# EAGLE schematic Mega 2560 Z21 (EAGLE 9.6.0)
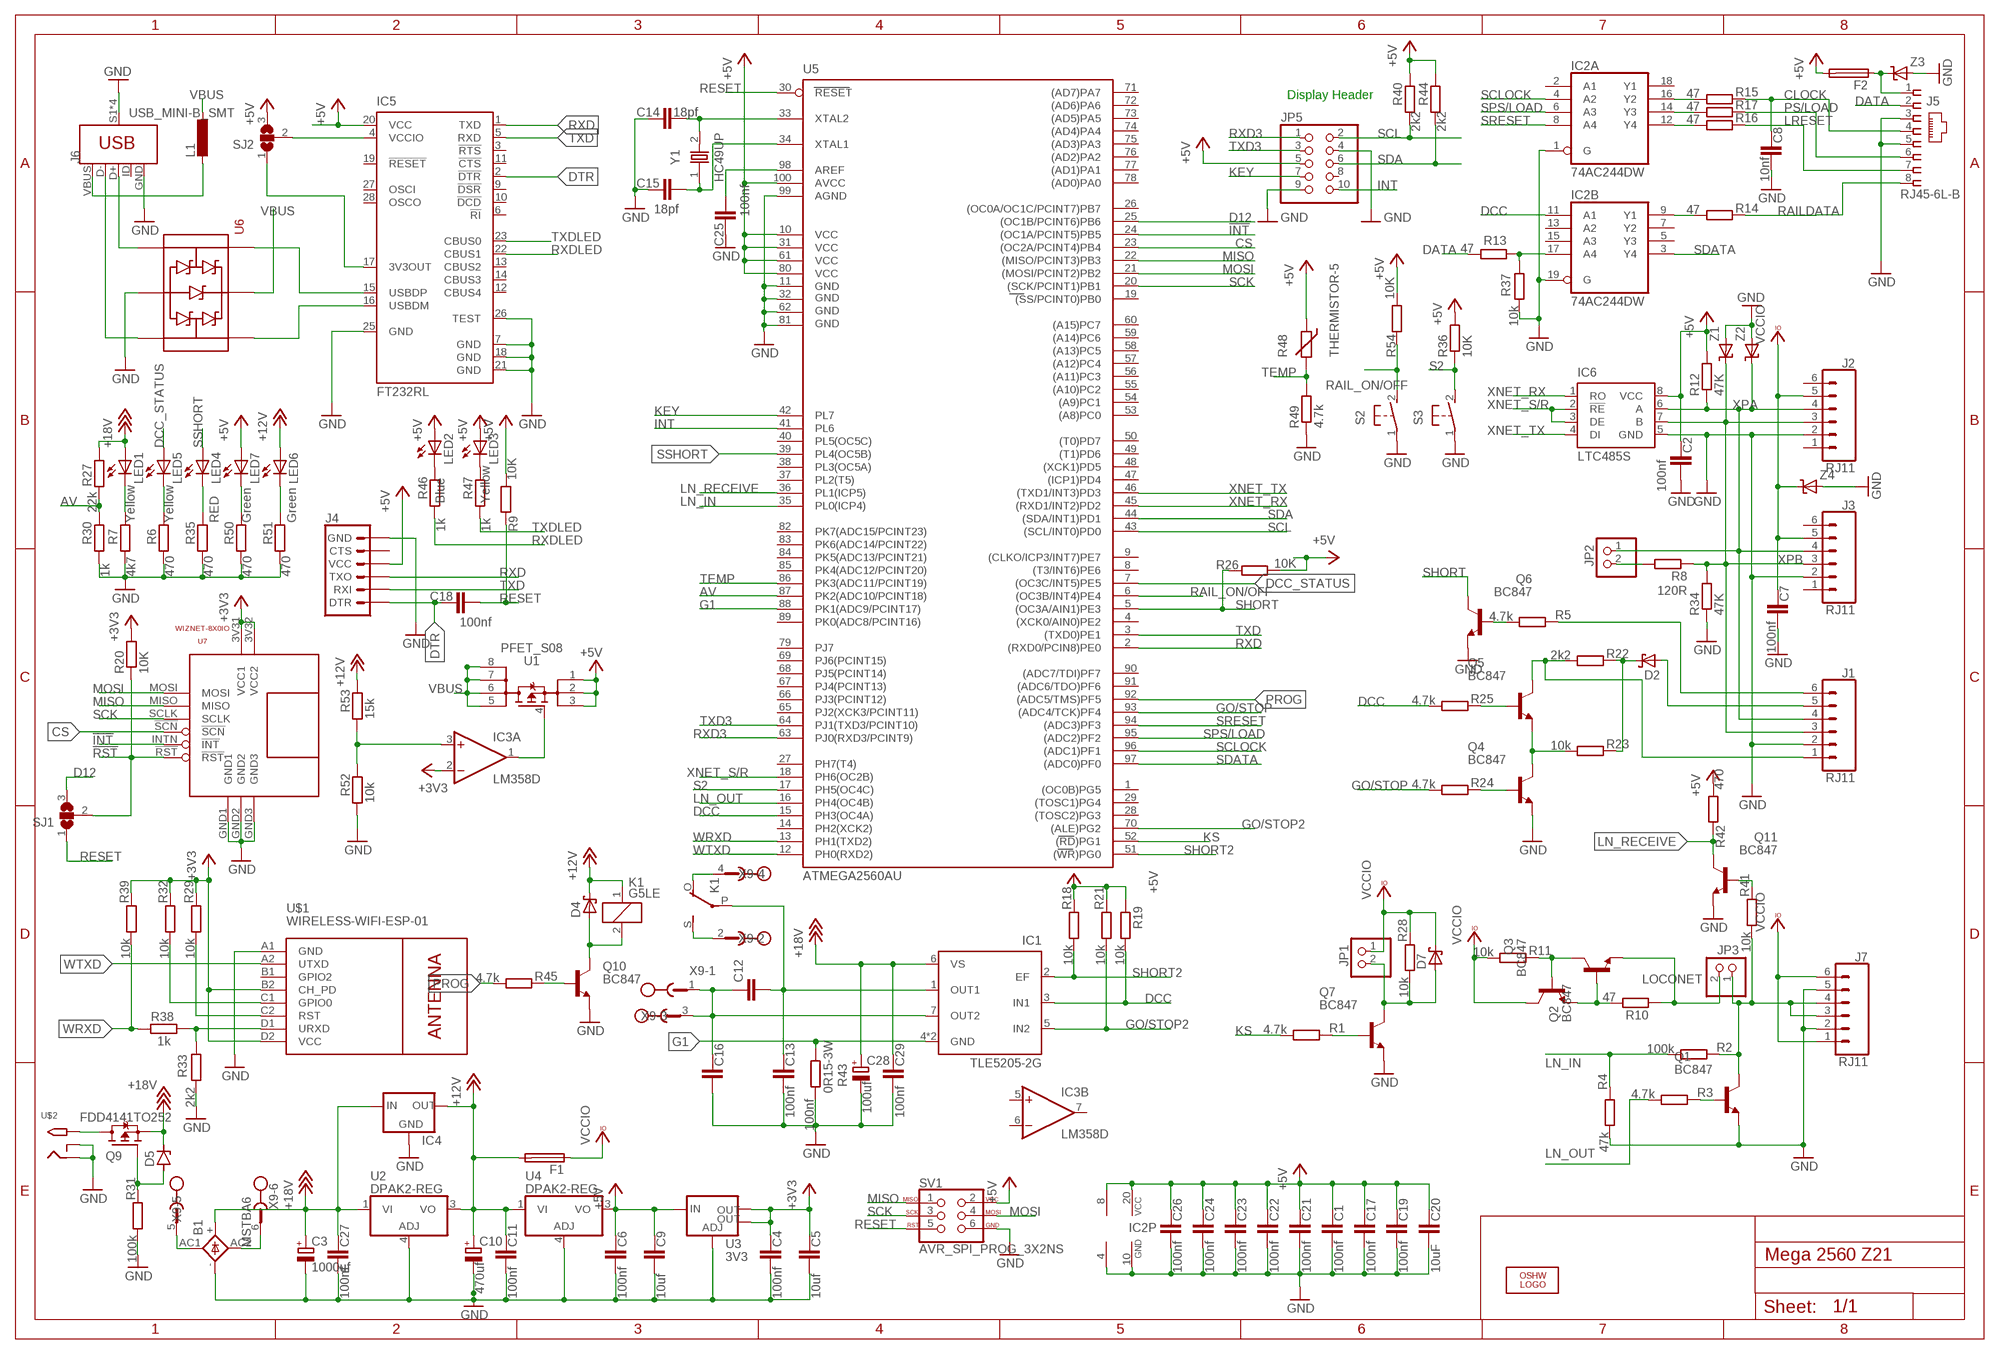
[diagram p0: schematic, sheet 1]

## Parts
B1  BRIDGE_RECTIFIER_6AMP  [KBU-6D]
C1  100nf  C-EUC0603  [C0603]
C2  100nf  C-EUC0603  [C0603]
C3  1000uf  CPOL-EUE5-13  [E5-13]
C4  100nf  C-EUC0603  [C0603]
C5  10uf  C-EUC0805  [C0805]
C6  100nf  C-EUC0603  [C0603]
C7  100nf  C-EUC0603  [C0603]
C8  10nf  C-EUC0603  [C0603]
C9  10uf  C-EUC0805  [C0805]
C10  470uf  CPOL-EUE5-13  [E5-13]
C11  100nf  C-EUC0603  [C0603]
C12  C-EUC1812  [C1812]
C13  100nf  C-EUC1206  [C1206]
C14  18pf  C-EUC0603  [C0603]
C15  18pf  C-EUC0603  [C0603]
C16  100nf  C-EUC1206  [C1206]
C17  100nf  C-EUC0603  [C0603]
C18  100nf  C-EUC0603  [C0603]
C19  100nf  C-EUC0603  [C0603]
C20  10uF  C-EUC0805  [C0805]
C21  100nf  C-EUC0603  [C0603]
C22  100nf  C-EUC0603  [C0603]
C23  100nf  C-EUC0603  [C0603]
C24  100nf  C-EUC0603  [C0603]
C25  100nf  C-EUC0603  [C0603]
C26  100nf  C-EUC0603  [C0603]
C27  100nf  C-EUC0805  [C0805]
C28  100uf  CPOL-EUE2-5  [E2-5]
C29  100nf  C-EUC1206  [C1206]
D2  MICROSMD-SCHOTTKY-DIODE  [MICROSMP]
D4  MICROSMD-SCHOTTKY-DIODE  [MICROSMP]
D5  ZENER-DIODESOT23  [SOT23]
D7  MICROSMD-SCHOTTKY-DIODE  [MICROSMP]
F1  TE5  [TE5]
F2  TE5  [TE5]
IC1  TLE5205-2G  [P-TO263-7-1]
IC2  74AC244DW  [SO20W]
IC3  LM358D  [SO08]
IC4  78XXS  [78XXS]
IC5  FT232RL  [SSOP28]
IC6  LTC485S  [SOIC8]
J1  RJ11  RJ11-6  [RJ11-6]
J2  RJ11  RJ11-6  [RJ11-6]
J3  RJ11  RJ11-6  [RJ11-6]
J4  6_PIN_SERIAL_TARGET  [1X06]
J5  RJ45-6L-B  [RJ45-NO-SHIELD]
J6  USB_MINI-B_SMT  [USB-MINIB]
J7  RJ11  RJ11-6  [RJ11-6]
JP1  PINHD-1X2  [1X02]
JP2  PINHD-1X2  [1X02]
JP3  PINHD-1X2  [1X02]
JP5  PINHD-2X5  [2X05]
K1  G5LE  [G5LE]
L1  L-EUL2012C  [L2012C]
LED1  Yellow  LED3MM  [LED3MM]
LED2  Blue  LED3MM  [LED3MM]
LED3  Yellow  LED3MM  [LED3MM]
LED4  RED  LED3MM  [LED3MM]
LED5  Yellow  LED3MM  [LED3MM]
LED6  Green  LED3MM  [LED3MM]
LED7  Green  LED3MM  [LED3MM]
LOGO1  OSHW_LOGO_6MILX0200-NT  [OSHW_6X200_NOTEXT]
Q1  BC847  [SOT23]
Q2  BC847  [SOT23]
Q3  BC847  [SOT23]
Q4  BC847  [SOT23]
Q5  BC847  [SOT23]
Q6  BC847  [SOT23]
Q7  BC847  [SOT23]
Q9  FDD4141TO252  [TO252]
Q10  BC847  [SOT23]
Q11  BC847  [SOT23]
R1  4.7k  R-EU_R0603  [R0603]
R2  100k  R-EU_R0603  [R0603]
R3  4.7k  R-EU_R0603  [R0603]
R4  47k  R-EU_R0603  [R0603]
R5  4.7k  R-EU_R0603  [R0603]
R6  470  R-EU_R0603  [R0603]
R7  4k7  R-EU_R0603  [R0603]
R8  120R  R-EU_R0603  [R0603]
R9  10K  R-EU_R0603  [R0603]
R10  47  R-EU_R0603  [R0603]
R11  10k  R-EU_R0603  [R0603]
R12  47K  R-EU_R0603  [R0603]
R13  47  R-EU_R0603  [R0603]
R14  47  R-EU_R0603  [R0603]
R15  47  R-EU_R0603  [R0603]
R16  47  R-EU_R0603  [R0603]
R17  47  R-EU_R0603  [R0603]
R18  10k  R-EU_R0603  [R0603]
R19  10k  R-EU_R0603  [R0603]
R20  10K  R-EU_R0603  [R0603]
R21  10k  R-EU_R0603  [R0603]
R22  2k2  R-EU_R0603  [R0603]
R23  10k  R-EU_R0603  [R0603]
R24  4.7k  R-EU_R0603  [R0603]
R25  4.7k  R-EU_R0603  [R0603]
R26  10K  R-EU_R0603  [R0603]
R27  22k  R-EU_R0603  [R0603]
R28  10k  R-EU_R0603  [R0603]
R29  10k  R-EU_R0603  [R0603]
R30  1k  R-EU_R0603  [R0603]
R31  100k  R-EU_R0603  [R0603]
R32  10k  R-EU_R0603  [R0603]
R33  2k2  R-EU_R0603  [R0603]
R34  47K  R-EU_R0603  [R0603]
R35  470  R-EU_R0603  [R0603]
R36  10K  R-EU_R0603  [R0603]
R37  10k  R-EU_R0603  [R0603]
R38  1k  R-EU_R0603  [R0603]
R39  10k  R-EU_R0603  [R0603]
R40  2k2  R-EU_R0603  [R0603]
R41  10k  R-EU_R0603  [R0603]
R42  470  R-EU_R0603  [R0603]
R43  0R15-3W  R-EU_0817/7V  [P0817V]
R44  2k2  R-EU_R0603  [R0603]
R45  4.7k  R-EU_R0603  [R0603]
R46  1k  R-EU_R0603  [R0603]
R47  1k  R-EU_R0603  [R0603]
R48  THERMISTOR-5  [R-5]
R49  4.7k  R-EU_R0603  [R0603]
R50  470  R-EU_R0603  [R0603]
R51  470  R-EU_R0603  [R0603]
R52  10k  R-EU_R0603  [R0603]
R53  15k  R-EU_R0603  [R0603]
R54  10K  R-EU_R0603  [R0603]
S2  31-XX  [B3F-31XX]
S3  31-XX  [B3F-31XX]
SJ1  SJ2W  [SJ_2]
SJ2  SJ2W  [SJ_2]
SV1  AVR_SPI_PROG_3X2NS  [2X3-NS]
U1  PFET_S08  [SO08]
U2  DPAK2-REG  [DPAK2]
U3  3V3  V_REG_LM1117SOT223  [SOT223]
U4  DPAK2-REG  [DPAK2]
U5  ATMEGA2560AU  [TQFP100]
U6  UABLC6-2SOT23-6L  [SOT95P280X145-6N]
U7  WIZNET-8X0IO  [WIZ850IO]
U$1  WIRELESS-WIFI-ESP-01  [WIRELESS-WIFI-ESP-01]
U$2  2.1MMJACKTHM  [PJ-102A]
X9  MSTBA6  [MSTBA6]
Y1  HC49UP  [HC49UP]
Z1  TRANSZORB-SMA  [SMA]
Z2  TRANSZORB-SMA  [SMA]
Z3  TRANSZORB-SMA  [SMA]
Z4  TRANSZORB-SMA  [SMA]

## Nets
!INT: U5.24((OC1A/PCINT5)PB5) U7.INTN(!INT)
!RST: R20.1 SJ1.2 U7.!RST
+3V3: C4.1 C5.1 IC3.2(A:-IN) R20.2 R29.1 R32.1 R39.1 U3.2(OUT) U3.4(OUT) U7.3V31(VCC1) U7.3V32(VCC2) U$1.B2(CH_PD) U$1.D2(VCC)
+5V: C1.1 C2.1 C6.1 C9.1 C17.1 C19.1 C20.1 C21.1 C22.1 C23.1 C24.1 C26.1 F2.2 IC2.20(P:VCC) IC3.8(P:V+) IC5.20(VCC) IC6.8(VCC) J4.4(VCC) JP5.5 LED2.A LED3.A LED7.A R9.2 R12.2 R18.1 R19.1 R21.1 R26.2 R36.2 R40.2 R42.2 R44.2 R48.1 R54.2 SJ2.3 SV1.2 U1.1(S1) U1.2(S2) U1.3(S3) U3.3(IN) U4.3(VO) U5.10(VCC) U5.31(VCC1) U5.61(VCC2) U5.80(VCC3) U5.100(AVCC)
+12V: C10.+ C11.1 D4.C F1.2 IC4.OUT K1.1 LED6.A R53.2 U2.3(VO) U4.1(VI)
+18V: B1.+ C3.+ C27.1 C28.+ C29.1 D5.3(C) IC1.6(VS) IC4.IN LED1.A Q9.2(S) R27.2 U2.1(VI)
AV: R27.1 R30.2 U5.87(PK2(ADC10/PCINT18))
CLOCK: C8.1 J5.4 R15.1
CS: U5.23((OC2A/PCINT4)PB4) U7.!SCN
D12: SJ1.3 U5.25((OC1B/PCINT6)PB6)
DATA: J5.2 R13.2
DCC: IC1.3(IN1) IC2.11(B:A1) R19.2 R25.2 U5.15(PH3(OC4A))
DCC_STATUS: LED5.A U5.7((OC3C/INT5)PE5)
DTR: C18.1 IC5.2(!DTR) J4.1(DTR)
G1: IC1.4(GND) IC1.8(GND) R43.2 U5.88(PK1(ADC9/PCINT17))
GND: B1.- C1.2 C2.2 C3.- C4.2 C5.2 C6.2 C7.2 C8.2 C9.2 C10.- C11.2 C13.2 C14.1 C15.1 C16.2 C17.2 C19.2 C20.2 C21.2 C22.2 C23.2 C24.2 C25.1 C26.2 C27.2 C28.- C29.2 IC2.1(A:G) IC2.10(P:GND) IC2.19(B:G) IC3.4(P:V-) IC4.GND IC5.7(GND) IC5.18(GND) IC5.21(GND) IC5.25(GND) IC5.26(TEST) IC6.5(GND) J1.2 J2.2 J3.2 J4.6(GND) J5.3 J5.5 J6.GND J6.S1(SHIELD) J6.S2(SHIELD) J6.S3(SHIELD) J6.S4(SHIELD) J7.2 J7.5 JP5.4 JP5.9 Q1.2(E) Q4.2(E) Q6.2(E) Q7.2(E) Q10.2(E) Q11.2(E) R4.2 R6.1 R7.1 R30.1 R31.2 R33.2 R34.1 R35.1 R37.2 R43.1 R49.1 R50.1 R51.1 R52.1 S2.1(P) S3.1(P) SV1.6 U2.4(ADJ) U3.1(ADJ) U4.4(ADJ) U5.11(GND) U5.32(GND1) U5.62(GND2) U5.81(GND3) U5.99(AGND) U6.2(GND) U7.GND1 U7.GND2 U7.GND3 U$1.A1(GND) U$2.RING U$2.RING_SW Z1.A Z2.A Z3.A Z4.A
GO/STOP: R24.2 U5.93((ADC4/TCK)PF4)
GO/STOP2: IC1.5(IN2) R21.2 U5.70((ALE)PG2)
INT: JP5.10 U5.41(PL6)
KEY: JP5.7 U5.42(PL7)
KS: R1.2 U5.52((RD)PG1)
LN_IN: R2.2 R4.1 U5.35(PL0(ICP4))
LN_OUT: R3.2 U5.16(PH4(OC4B))
LN_RECEIVE: Q11.3(C) R42.1 U5.36(PL1(ICP5))
LOCONET: JP3.2 Q2.2(E) R10.1
LRESET: J5.7 R16.1
MISO: SV1.1 U5.22((MISO/PCINT3)PB3) U7.MISO
MOSI: SV1.4 U5.21((MOSI/PCINT2)PB2) U7.MOSI
N$1: LED5.K(C) R6.2
N$2: C25.2 U5.98(AREF)
N$3: LED4.K(C) R35.2
N$4: IC2.16(A:Y2) R15.2
N$5: Q2.3(C) Q3.1(B) R11.1
N$6: Q1.1(B) R3.1
N$7: D7.A JP1.2 Q7.3(C) R28.2
N$8: Q2.1(B) Q3.2(E) R10.2
N$9: IC2.17(B:A4) R13.1 R37.1
N$10: IC2.14(A:Y3) R17.2
N$11: IC2.12(A:Y4) R16.2
N$12: Q7.1(B) R1.1
N$13: IC2.9(B:Y1) R14.2
N$14: Q5.1(B) R25.1
N$15: Q4.1(B) R24.1
N$16: Q4.3(C) Q5.2(E) R23.2
N$17: D2.A J1.5
N$18: D2.C R22.1 R23.1
N$19: J1.1 Q5.3(C) R22.2
N$20: Q6.1(B) R5.2
N$21: J1.6 R5.1
N$22: D5.1(A) Q9.1(G) R31.1
N$23: Q9.3(D) U$2.TIP
N$24: C14.2 U5.33(XTAL2) Y1.2
N$25: C12.2 C13.1 IC1.1(OUT1) K1.P(2:P)
N$26: C12.1 C16.1 IC1.7(OUT2) X9.1 X9.3
N$27: F2.1 J5.1 Z3.C
N$28: C15.2 U5.34(XTAL1) Y1.1
N$29: LED1.K(C) R7.2
N$30: R32.2 U$1.C1(GPIO0)
N$31: R29.2 U$1.C2(RST)
N$32: K1.S(2:S) X9.2
N$33: JP2.2 R8.2
N$34: B1.AC2 X9.6
N$35: R33.1 R38.2 U$1.D1(URXD)
N$36: J6.D+ U6.3(IO2I)
N$37: K1.O(2:O) X9.4
N$38: J6.D- U6.1(IO1I)
N$39 [pwr]: D4.A K1.2 Q10.3(C)
N$40: B1.AC1 X9.5
N$41: LED7.K(C) R50.2
N$42: Q10.1(B) R45.1
N$43: J7.3 J7.4 JP3.1 Q1.3(C) R2.1 R41.2
N$44: Q11.1(B) R41.1
N$45: IC5.15(USBDP) U6.4(IO2O)
N$46: LED2.K(C) R46.2
N$47: LED3.K(C) R47.2
N$48: IC5.16(USBDM) U6.6(IO1O)
N$49: J6.VBUS L1.2
N$50: LED6.K(C) R51.2
N$52: IC5.4(VCCIO) SJ2.2
N$53: IC5.17(3V3OUT) SJ2.1
N$55: IC3.1(A:OUT) U1.4(G)
N$56: IC3.3(A:+IN) R52.2 R53.1
PROG: R45.2 U5.92((ADC5/TMS)PF5)
PS/LOAD: J5.6 R17.1
RAIL_ON/OFF: R54.1 S2.2(S) U5.6((OC3B/INT4)PE4)
RAILDATA: J5.8 R14.1
RESET: C18.2 R9.1 SJ1.1 SV1.5 U5.30(RESET)
RXD: IC5.1(TXD) J4.3(TXO) U5.2((RXD0/PCIN8)PE0)
RXD3: JP5.1 U5.63(PJ0(RXD3/PCINT9))
RXDLED: IC5.22(CBUS1) R46.1
S2: R36.1 S3.2(S) U5.17(PH5(OC4C))
SCK: SV1.3 U5.20((SCK/PCINT1)PB1) U7.SCLK
SCL: JP5.2 R40.1 U5.43((SCL/INT0)PD0)
SCLOCK: IC2.4(A:A2) U5.96((ADC1)PF1)
SDA: JP5.6 R44.1 U5.44((SDA/INT1)PD1)
SDATA: IC2.3(B:Y4) U5.97((ADC0)PF0)
SHORT: Q6.3(C) R26.1 U5.5((OC3A/AIN1)PE3)
SHORT2: IC1.2(EF) R18.2 U5.51((WR)PG0)
SPS/LOAD: IC2.6(A:A3) U5.95((ADC2)PF2)
SRESET: IC2.8(A:A4) U5.94((ADC3)PF3)
SSHORT: LED4.A U5.39(PL4(OC5B))
TEMP: R48.2 R49.2 U5.86(PK3(ADC11/PCINT19))
TXD: IC5.5(RXD) J4.2(RXI) U5.3((TXD0)PE1)
TXD3: JP5.3 U5.64(PJ1(TXD3/PCINT10))
TXDLED: IC5.23(CBUS0) R47.1
VBUS: L1.1 U1.5(D4) U1.6(D3) U1.7(D2) U1.8(D1) U6.5(VDD)
VCCIO: C7.1 D7.C F1.1 J2.5 J3.5 J7.1 J7.6 JP1.1 Q3.3(C) R11.2 R28.1 Z4.C
WRXD: R38.1 R39.2 U5.13(PH1(TXD2))
WTXD: U5.12(PH0(RXD2)) U$1.A2(UTXD)
XNET_RX: IC6.1(RO) U5.45((RXD1/INT2)PD2)
XNET_S/R: IC6.2(!RE) IC6.3(DE) U5.18(PH6(OC2B))
XNET_TX: IC6.4(DI) U5.46((TXD1/INT3)PD3)
XPA: IC6.6(A) J1.4 J2.4 J3.4 JP2.1 R12.1 Z2.C
XPB: IC6.7(B) J1.3 J2.3 J3.3 R8.1 R34.2 Z1.C
Unconnected: IC2.2(A:A1) IC2.5(B:Y3) IC2.7(B:Y2) IC2.13(B:A2) IC2.15(B:A3) IC2.18(A:Y1) IC3.5(B:+IN) IC3.6(B:-IN) IC3.7(B:OUT) IC5.3(!RTS) IC5.6(!RI) IC5.9(!DSR) IC5.10(!DCD) IC5.11(!CTS) IC5.12(CBUS4) IC5.13(CBUS2) IC5.14(CBUS3) IC5.19(!RESET) IC5.27(OSCI) IC5.28(OSCO) J2.1 J2.6 J3.1 J3.6 J4.5(CTS) J6.ID JP5.8 U5.1((OC0B)PG5) U5.4((XCK0/AIN0)PE2) U5.8((T3/INT6)PE6) U5.9((CLKO/ICP3/INT7)PE7) U5.14(PH2(XCK2)) U5.19((SS/PCINT0)PB0) U5.26((OC0A/OC1C/PCINT7)PB7) U5.27(PH7(T4)) U5.28((TOSC2)PG3) U5.29((TOSC1)PG4) U5.37(PL2(T5)) U5.38(PL3(OC5A)) U5.40(PL5(OC5C)) U5.47((ICP1)PD4) U5.48((XCK1)PD5) U5.49((T1)PD6) U5.50((T0)PD7) U5.53((A8)PC0) U5.54((A9)PC1) U5.55((A10)PC2) U5.56((A11)PC3) U5.57((A12)PC4) U5.58((A13)PC5) U5.59((A14)PC6) U5.60((A15)PC7) U5.65(PJ2(XCK3/PCINT11)) U5.66(PJ3(PCINT12)) U5.67(PJ4(PCINT13)) U5.68(PJ5(PCINT14)) U5.69(PJ6(PCINT15)) U5.71((AD7)PA7) U5.72((AD6)PA6) U5.73((AD5)PA5) U5.74((AD4)PA4) U5.75((AD3)PA3) U5.76((AD2)PA2) U5.77((AD1)PA1) U5.78((AD0)PA0) U5.79(PJ7) U5.82(PK7(ADC15/PCINT23)) U5.83(PK6(ADC14/PCINT22)) U5.84(PK5(ADC13/PCINT21)) U5.85(PK4(ADC12/PCINT20)) U5.89(PK0(ADC8/PCINT16)) U5.90((ADC7/TDI)PF7) U5.91((ADC6/TDO)PF6) U$1.B1(GPIO2)

## Notes on the sheet
- Display Header

## Library data of the parts
B1 = GJR:BRIDGE_RECTIFIER_6AMP: 6 Amp in line Bridge rectifier; PARTNUMBER: KBU 6D
C1 C2 C4-C9 C11-C27 C29 = rcl:C-EU: CAPACITOR, European symbol
C3 C10 = rcl:CPOL-EU: POLARIZED CAPACITOR, European symbol; SPICEPREFIX: C
C28 = rcl:CPOL-EU: POLARIZED CAPACITOR, European symbol
D2 D4 D7 = GJR:MICROSMD-SCHOTTKY-DIODE; FARNELL: 1815644RL; MANUFACTURER: Vishay
D5 = diode:ZENER-DIODE: Z-Diode
F1 F2 = fuse:TE5: FUSE Wickmann; OC_FARNELL: unknown; OC_NEWARK: unknown
IC1 = infineon:TLE5205-2: 5-A H-Bridge for DC-Motor Applications Source: http://www.infineon.com .. tle5205-2.pdf; OC_FARNELL: unknown; OC_NEWARK: unknown
IC2 = 74xx-eu:74*244: Octal BUFFER and LINE DRIVER, 3-state
IC3 = linear:LM358: OP AMP also LM158; LM258; LM2904 Source: http://cache.national.com/ds/LM/LM158.pdf
IC4 = v-reg:78XXS: VOLTAGE REGULATOR
IC5 = ftdichip:FT232R: Source: http://www.ftdichip.com/Documents/DataSheets/DS_FT232R_v104.pdf; MPN: FT232RL; OC_FARNELL: 1146032; OC_NEWARK: 91K9918
IC6 = linear-technology:LTC485: Low Power RS485 Interface Transceiver Source: http://www.linear.com/pc/downloadDocument.do?navId=H0,C1,C1007,C1017,P2064,D1718; OC_FARNELL: unknown; OC_NEWARK: unknown
J1-J3 J7 = SparkFun-Connectors:RJ11-6: RJ11 Jack - 6 pin Commonly found on CAT3 devices and some Microchip programmers. Here is the connector we sell at SparkFun: RJ11 6-Pin Connector <https://www.sparkfun.com/products/132> (PRT-00132) Datasheet <http://www.sparkfun.com/datasheets/Prototyping/Connectors/RJ11-Datasheet.pdf> It is used on this SparkFun product: SparkFun Weather Shield <https://www.sparkfun.com/products/12081> (DEV-12081) Weather Meters <https://www.sparkfun.com/products/8942> (SEN-08942); PROD_ID: CONN-08590; SF_ID: PRT-00132
J4 = SparkFun-Connectors:6_PIN_SERIAL_TARGET: 6-pin header connection for use with the "FTDI BASIC" pinout - TARGET SIDE. Also known as "Arduino Serial Program Header". It is used to mate with our FTDI Basic serial programmers using the Arduino IDE. Note, this device has "TARGET" in the name. It is intended to be used on a design that contains a target micro-controller that you wish to program. The "sister" device, named "CABLE" is inteneded to be used on a design that usually lives on the end of your USB cable and prvides the converter chip (FTDI232 or FTDI231x) to commnicate serial RX/TX. You can populate with some of these: Break Away Headers - Straight <https://www.sparkfun.com/products/116> (PRT-00116) For reference (or to suit your programming needs) check out these designs: SparkFun FTDI Basic Breakout - 5V <https://www.sparkfun.com/products/9716> (DEV-09716) SparkFun FTDI Basic Breakout - 3.3V <https://www.sparkfun.com/products/9873> (DEV-09873) SparkFun FTDI SmartBasic <https://www.sparkfun.com/products/12935> (DEV-12935) SparkFun Beefy 3 - FTDI Basic Breakout <https://www.sparkfun.com/products/13746> (DEV-13746)
J5 = con-tycoelectronics:RJ45: CORCOM Modular RJ Jacks No Shield Source: www.tycoelectronics.com .. ENG_DS_1654001_1099_RJ_L_0507.pdf; MPN: RJ45-6L-B; OC_FARNELL: unknown; OC_NEWARK: 16R6090
J6 = SparkFun-Connectors:USB_MINI-B: USB type Mini-B Connector Breaks out 5th pin, and includes shield pins if needed. SparkFun Products: SparkFun FTDI Basic Breakout <https://www.sparkfun.com/products/9716> SparkFun XBee Explorer USB <https://www.sparkfun.com/products/11812> SparkFun Redboard <https://www.sparkfun.com/products/12757>; PROD_ID: CONN-08193; SF_ID: PRT-00587
JP1-JP3 = pinhead:PINHD-1X2: PIN HEADER
JP5 = pinhead:PINHD-2X5: PIN HEADER
K1 = relay:G5LE: RELAY 1 x switch, 10 A/120 V AC, 8 A/30 V DC, Omron; OC_FARNELL: unknown; OC_NEWARK: unknown
L1 = rcl:L-EU: INDUCTOR, European symbol
LED1-LED7 = adafruit:LED: LED OSRAM: - CHIPLED LG R971, LG N971, LY N971, LG Q971, LY Q971, LO R971, LY R971 LH N974, LH R974 LS Q976, LO Q976, LY Q976 LO Q996 - Hyper CHIPLED LW Q18S LB Q993, LB Q99A, LB R99A - SideLED LS A670, LO A670, LY A670, LG A670, LP A670 LB A673, LV A673, LT A673, LW A673 LH A674 LY A675 LS A676, LA A676, LO A676, LY A676, LW A676 LS A679, LY A679, LG A679 - Hyper Micro SIDELED® LS Y876, LA Y876, LO Y876, LY Y876 LT Y87S - SmartLED LW L88C, LW L88S LB L89C, LB L89S, LG L890 LS L89K, LO L89K, LY L89K LS L896, LA L896, LO L896, LY L896 - TOPLED LS T670, LO T670, LY T670, LG T670, LP T670 LSG T670, LSP T670, LSY T670, LOP T670, LYG T670 LG T671, LOG T671, LSG T671 LB T673, LV T673, LT T673, LW T673 LH T674 LS T676, LA T676, LO T676, LY T676, LB T676, LH T676, LSB T676, LW T676 LB T67C, LV T67C, LT T67C, LS T67K, LO T67K, LY T67K, LW E67C LS E67B, LA E67B, LO E67B, LY E67B, LB E67C, LV E67C, LT E67C LW T67C LS T679, LY T679, LG T679 LS T770, LO T770, LY T770, LG T770, LP T770 LB T773, LV T773, LT T773, LW T773 LH T774 LS E675, LA E675, LY E675, LS T675 LS T776, LA T776, LO T776, LY T776, LB T776 LHGB T686 LT T68C, LB T68C - Hyper Mini TOPLED® LB M676 - Mini TOPLED Santana® LG M470 LS M47K, LO M47K, LY M47K Source: http://www.osram.convergy.de/
LOGO1 = ohw-logo:OSHW_LOGO_6MIL
Q1-Q7 Q10 Q11 = nxp_60:BC847: 45 V, 100 mA NPN general-purpose transistors NPN general-purpose transistor AAL Eindhoven MK
Q9 = transistor-fet:FDD4141: P-Channel PowerTrench® MOSFET Source: FDD4141.pdf
R1-R42 R44-R47 R49-R54 = rcl:R-EU_: RESISTOR, European symbol
R43 = rcl:R-EU_: RESISTOR, European symbol; SPICEPREFIX: R
R48 = varistor:THERMISTOR: THERMISTOR
S2 S3 = switch-omron:31-XX: OMRON SWITCH; MPN: B3F-3100; OC_FARNELL: 959704; OC_NEWARK: 36M3582
SJ1 SJ2 = jumper:SJ2W: SMD solder JUMPER
SV1 = SparkFun-Connectors:AVR_SPI_PROG_3X2: AVR ISP 6 Pin This is the reduced ISP connector for AVR programming. Common on Arduino. This footprint will take up less PCB space and can be used with a 10-pin to 6-pin adapter such as SKU: BOB-08508 **Special note about "TEST_POINT" package. The stop mask is on the top side, so if you want your programming test points to be on the bottom of your board, make sure to place this package on the bottom side of the board. This also ensure that the orientation to program from the bottom side will be correct. SparkFun Products: SparkFun ISP Pogo Adapter <https://www.sparkfun.com/products/11591> - NS Tiny AVR Programmer <https://www.sparkfun.com/products/11801> -PTH
U1 = GJR:PFET_S08: SO8 PFET; FARNELL: 2579999; MANUFACTURER: Infineon; PARTNUMBER: IRF9388TRFPBF
U2 U4 = GJR:DPAK2-REG: DPAK2 LDO regulator; FARNELL: 1815505; PARTNUMBER: MC78M05CDTG
U3 = SparkFun-IC-Power:V_REG_LM1117: Voltage Regulator LM1117 Standard adjustable voltage regulator but in SMD form. Spark Fun Electronics SKU : COM-00595; PROD_ID: VREG-08170
U5 = SparkFun-DigitalIC:ATMEGA2560: Atmel 100-pin 8-bit uC 64/128/256 Kbytes FLASH 4 Kbytes EEPROM 8 Kbytes SRAM 86 General Purpose I/O pins 12-channels16-bit PWM 4 x Serial USARTs 16-channels 10-bit A/D
U6 = GJR:UABLC6-2: USB 2 Protection network
U7 = GJR:WIZNET-8X0IO: Wiznet compact Ethernet modules; MANUFACTURER: Wiznet; PARTNUMBER: W850io
U$1 = diy-modules:WIRELESS-WIFI-ESP-01: Wireless Wi-Fi ESP-01 Module based on ESP8266 chip Click here to find device on ebay.com <http://www.ebay.com/sch/esp8266+esp+01+transceiver>
U$2 = adafruit:2.1MMJACK: 2.1mm x 5.5mm THM DC jack with internal switch. Digikey part #PJ-102A, 4UCON part #05537 2.1mm x 5.5mm SMT DC jack with internal switch. Digikey part #PJ-002A-SMT, 4UCON part #03267 By microbuilder.eu & adafruit.com
X9 = con-phoenix-508:MSTBA6: PHOENIX; MF: FARNELL; MPN: 1757284; OC_FARNELL: 3705213; OC_NEWARK: 71C4165
Y1 = GJR:HC49UP: HC49 SMD Crystal
Z1-Z4 = GJR:TRANSZORB-SMA: SMA uni-directional Transzorb

## Net classes
1 pwr: width 0.2 mm, drill 0.3 mm, clearance 0.205 mm to class 0, clearance 0.205 mm
2 gnd: width 0.2 mm, drill 0.3 mm, clearance 0.205 mm to class 0, clearance 0.205 mm to class 1, clearance 0.205 mm